# EAGLE design Qwiic_1Wire_to_I2C_Bridge_DS28E17_MILLABLE2 (EAGLE 7.6.0)
ABBREV: hb1; PROJECT: Heading Board
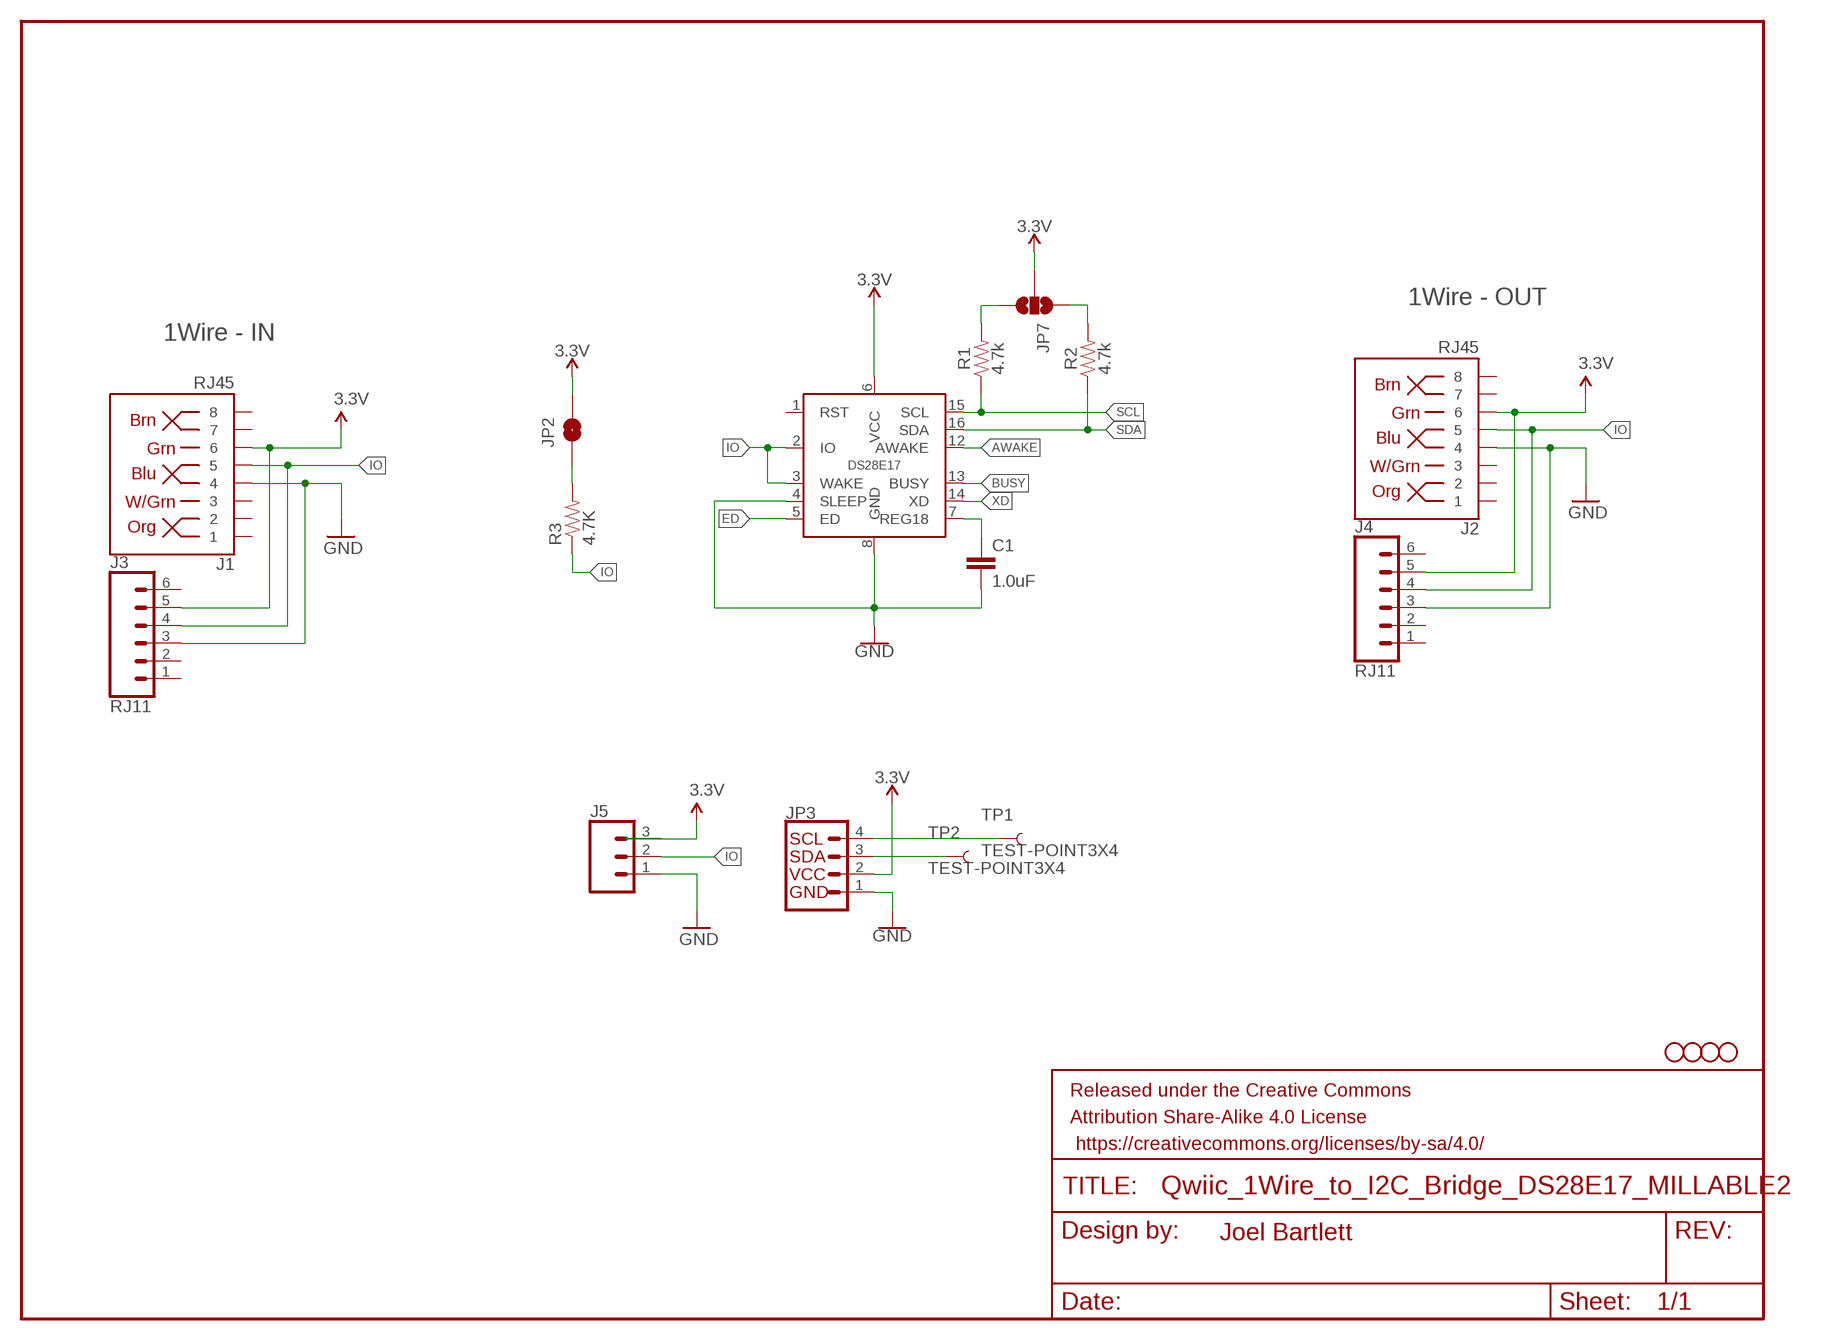
[diagram p0: schematic, sheet 1]

## Parts
C1  1.0uF  1.0UF-0603-16V-10%  [0603]
FRAME1  FRAME-LETTER  [CREATIVE_COMMONS]
H1  STAND-OFF  [STAND-OFF]
H2  STAND-OFF  [STAND-OFF]
H3  STAND-OFF  [STAND-OFF]
H4  STAND-OFF  [STAND-OFF]
J1  RJ45  RJ45-8  [RJ45-8]
J2  RJ45  RJ45-8  [RJ45-8]
J3  RJ11  RJ11-6  [RJ11-6]
J4  RJ11  RJ11-6  [RJ11-6]
J5  CONN_03  [1X03]
JP2  JUMPER-SMT_2_NO_NO-SILK  [SMT-JUMPER_2_NO_NO-SILK]
JP3  I2C_STANDARDJS-1MM  [1X04_1MM_RA]
JP7  JUMPER-SMT_3_NO_NO-SILK  [SMT-JUMPER_3_NO_NO-SILK]
R1  4.7k  4.7KOHM-0603-1/10W-1%  [0603]
R2  4.7k  4.7KOHM-0603-1/10W-1%  [0603]
R3  4.7K  4.7KOHM-1/10W-1%(0603)  [0603-RES]
TP1  TEST-POINT3X4  [PAD.03X.04]
TP2  TEST-POINT3X4  [PAD.03X.04]
U$1  DS28E17  [TQFN-16]

## Nets
3.3V: J1.6 J2.6 J3.5 J4.5 J5.3 JP2.2 JP3.2(VCC) JP7.2 U$1.6(VCC)
AWAKE: U$1.12(AWAKE)
BUSY: U$1.13(BUSY)
ED: U$1.5(ED)
GND: C1.2 J1.4 J2.4 J3.3 J4.3 J5.1 JP3.1(GND) U$1.4(SLEEP) U$1.8(GND)
IO: J1.5 J2.5 J3.4 J4.4 J5.2 R3.1 U$1.2(IO) U$1.3(WAKE)
N$1: C1.1 U$1.7(REG18)
N$2: JP2.1 R3.2
N$3: JP7.1 R2.2
N$4: JP7.3 R1.2
N$5: JP3.4(SCL) TP1.P$1
N$6: JP3.3(SDA) TP2.P$1
SCL: R1.1 U$1.15(SCL)
SDA: R2.1 U$1.16(SDA)
XD: U$1.14(XD)
Unconnected: J1.1 J1.2 J1.3 J1.7 J1.8 J2.1 J2.2 J2.3 J2.7 J2.8 J3.1 J3.2 J3.6 J4.1 J4.2 J4.6 U$1.1(RST)

## Notes on the sheet
- 1Wire - OUT
- 1Wire - IN
- Joel Bartlett

## Library data of the parts
C1 = SparkFun-Capacitors:1.0UF: 1µF ceramic capacitors A capacitor is a passive two-terminal electrical component used to store electrical energy temporarily in an electric field.; PROD_ID: CAP-00868
FRAME1 = SparkFun-Aesthetics:FRAME-LETTER: Schematic Frame - Letter Standard 8.5x11 US Letter frame
H1-H4 = SparkFun-Hardware:STAND-OFF: Stand Off Drill holes for mechanically mounting via screws, standoffs, etc. Note: Use the keepout ring to avoid running the screw head into surrounding components. Variant Overviews STAND-OFF - Mechanical footprint for a #4 phillips button head screw. STAND-OFF-TIGHT - Mechanical footprint for a #4 phillips button head screw, Example SparkFun Products Screw - Phillips Head (1/4", 4-40, 10 pack) <https://www.sparkfun.com/products/10453> (PRT-10453) Screw - Phillips Head (1/2", 4-40, 10 pack) <https://www.sparkfun.com/products/10452> (PRT-10452) Screw - Phillips Head (3/4", 4-40, 10 pack) <https://www.sparkfun.com/products/10451> (PRT-10451) Screw - Phillips Head (1", 4-40, 10 pack) <https://www.sparkfun.com/products/10450> (PRT-10450)
J1 J2 = SparkFun-Connectors:RJ45-8: RJ45 Jack - 8 pin Simple RJ45, 8-pin connection. Commonly used for Cat5, Cat5e, and Cat6 Ethernet cables. Here is the connector we sell at SparkFun: RJ45 8-Pin Connector <https://www.sparkfun.com/products/643> (PRT-00643) Datasheet <https://cdn.sparkfun.com/datasheets/Prototyping/04908.pdf> It is used on this SparkFun product: SparkFun RJ45 Breakout <https://www.sparkfun.com/products/716> (BOB-00716) Note, you may also be interested in the "MAGJACK" version of this. It is basically a RJ45 connector, but also has some status LEDs built into the connector housing. You can check that out in this library at the device named "MAGJACK.dev" and see these products online: RJ45 Ethernet MagJack-Compatible <https://www.sparkfun.com/products/8534> (PRT-08534) SparkFun RJ45 MagJack Breakout <https://www.sparkfun.com/products/13021> (BOB-13021); PROD_ID: CONN-08506; SF_ID: PRT-00643
J3 J4 = SparkFun-Connectors:RJ11-6: RJ11 Jack - 6 pin Commonly found on CAT3 devices and some Microchip programmers. Here is the connector we sell at SparkFun: RJ11 6-Pin Connector <https://www.sparkfun.com/products/132> (PRT-00132) Datasheet <http://www.sparkfun.com/datasheets/Prototyping/Connectors/RJ11-Datasheet.pdf> It is used on this SparkFun product: SparkFun Weather Shield <https://www.sparkfun.com/products/12081> (DEV-12081) Weather Meters <https://www.sparkfun.com/products/8942> (SEN-08942); PROD_ID: CONN-08590; SF_ID: PRT-00132
J5 = SparkFun-Connectors:CONN_03: Multi connection point. Often used as Generic Header-pin footprint for 0.1 inch spaced/style header connections On any of the 0.1 inch spaced packages, you can populate with these: Break Away Headers - Straight <https://www.sparkfun.com/products/116> (PRT-00116) Break Away Male Headers - Right Angle <https://www.sparkfun.com/products/553> (PRT-00553) Female Headers <https://www.sparkfun.com/products/115> (PRT-00115) Break Away Headers - Machine Pin <https://www.sparkfun.com/products/117> (PRT-00117) Break Away Female Headers - Swiss Machine Pin <https://www.sparkfun.com/products/743> (PRT-00743) Stackable Header - 3 Pin (Female, 0.1") <https://www.sparkfun.com/products/13875> (PRT-13875) For SCREWTERMINALS and SPRING TERMINALS visit here: Screw Terimnals on SparkFun.com <https://www.sparkfun.com/search/results?term=Screw+Terminals> (5mm/3.5mm/2.54mm spacing) This device is also useful as a general connection point to wire up your design to another part of your project. Our various solder wires solder well into these plated through hole pads. Hook-Up Wire - Assortment (Stranded, 22 AWG) <https://www.sparkfun.com/products/11375> (PRT-11375) Hook-Up Wire - Assortment (Solid Core, 22 AWG) <https://www.sparkfun.com/products/11367> (PRT-11367) View the entire wire category on our website here <https://www.sparkfun.com/categories/141> Special notes: Molex polarized connector foot print use with SKU : PRT-08232 with associated crimp pins and housings.
JP2 = SparkFun-Jumpers:JUMPER-SMT_2_NO: Normally open jumper This jumper has two pads in close proximity to each other. Apply solder to close the connection. Round pads are easier to solder for beginners, but are a lot larger. SparkFun Product that uses the round pads: SparkFun EL Sequencer <https://www.sparkfun.com/products/12781>
JP3 = SparkX:I2C_STANDARD: SparkFun I2C Standard Pinout Header SparkFun has standardized on a pinout for all I2C based sensor breakouts. This pinout allows I2C boards to be plugged directly into the headers on Arduino Uno compatible boards, and to be daisy chained easily. Example SparkFun Products: SparkFun Atmospheric Sensor Breakout - BME280 <https://www.sparkfun.com/products/13676> SparkFun Altitude/Pressure Sensor Breakout - MPL3115A2 <https://www.sparkfun.com/products/11084> SparkFun TOF Range Finder Sensor - VL6180 <https://www.sparkfun.com/products/12785>
JP7 = SparkFun-Jumpers:JUMPER-SMT_3_NO: Normally open jumper This jumper has three pads in close proximity to each other. Apply solder to close the connection(s).
R1 R2 = SparkFun-Resistors:4.7KOHM: 4.7kΩ resistor A resistor is a passive two-terminal electrical component that implements electrical resistance as a circuit element. Resistors act to reduce current flow, and, at the same time, act to lower voltage levels within circuits. - Wikipedia; PROD_ID: RES-07857
R3 = SparkFun-Resistors:4.7KOHM-1/10W-1%(0603): RES-07857; PROD_ID: RES-07857
TP1 TP2 = SparkFun-Connectors:TEST-POINT: SparkFun Test Points Bare copper test points for troubleshooting or In-Circuit-Testing. These are used by our Production team for verifying production board runs using pogo-pins on test beds. SparkFun Products: SparkFun LSM9DS1 Breakout <https://www.sparkfun.com/products/13284> SparkFun PSOC <https://www.sparkfun.com/products/13714> SparkFun Load Cell Amplifier <https://www.sparkfun.com/products/13879>
U$1 = SparkX:DS28E17

## Net classes
0 default: width 0.203 mm
1 power: width 0.381 mm, clearance 0.254 mm

## Board
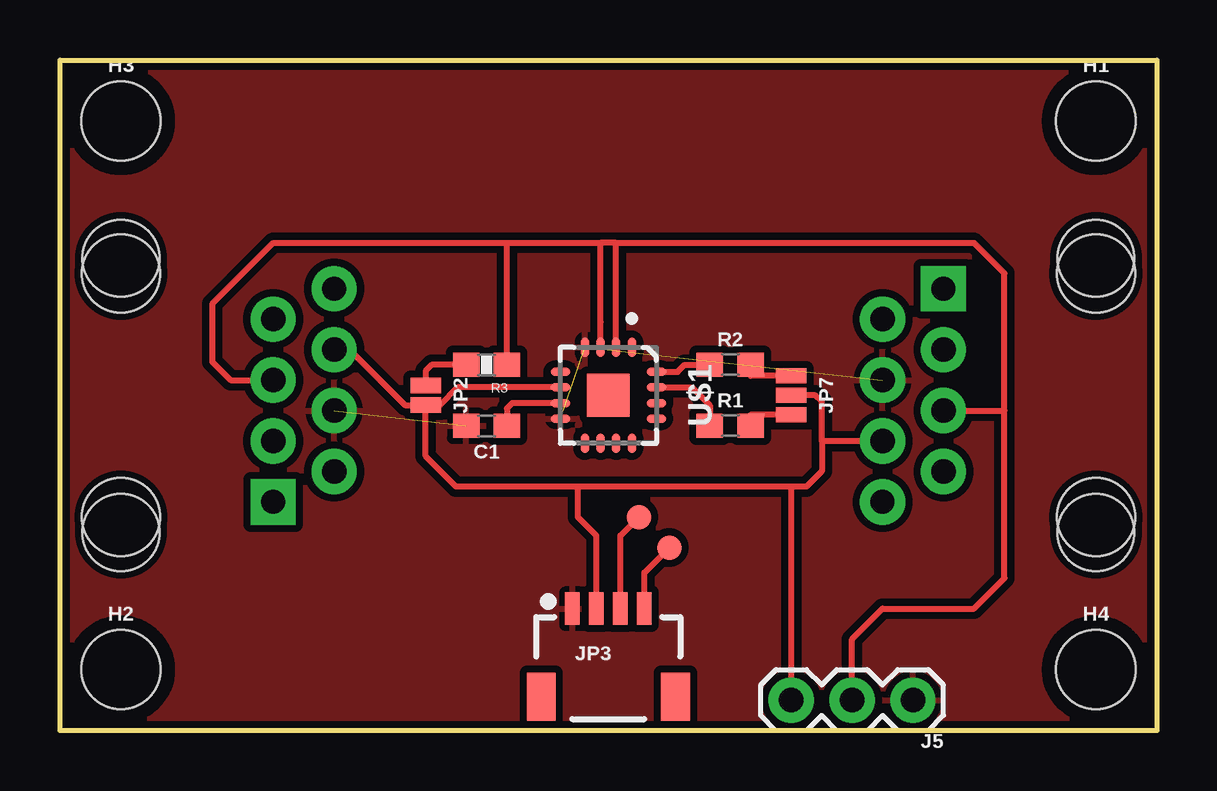
[diagram p1: board, top side]
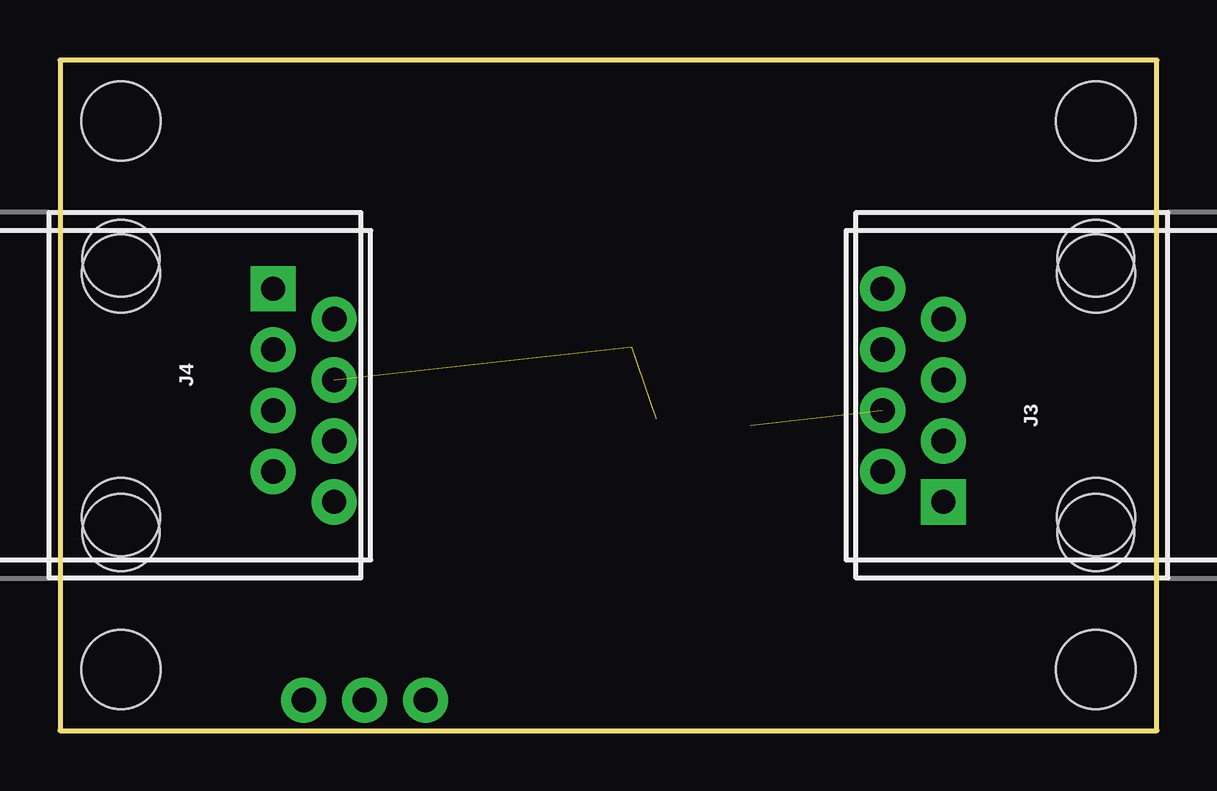
[diagram p2: board, bottom side, seen from below]

Size 45.72 x 27.94 mm. Coordinates in mm from the lower left corner, seen from the top.
Outline: 0,0 0,27.94 45.72,27.94 45.72,0 0,0
Copper layers (1*16): Top 0.035mm / dielectric 1.5mm / Bottom 0.035mm
Design rules "ITEADstudio_DRC": minimum track width 6mil, minimum drill 12mil, track to track 6mil, track to pad 6mil, pad to pad 6mil, via to via 6mil, smd to smd 0mil, copper to edge 10mil, drill to drill 10mil, minimum pad ring 10mil, minimum via ring 6mil, stop-mask expansion 2mil, vias tented up to drill 100mil, thermal gap 10mil

### Footprints (pad centres in the part's own frame; a part is rotated, then mirrored left to right if it is on the bottom)
0603 = smd 1.1 x 1: 1 -0.85,0; 2 0.85,0
STAND-OFF = hole 3.302: 0,0
RJ45-8 = drill 1 pad 1.88 square: 1 -4.445,6.35 | drill 1 pad 1.88: 2 -3.175,8.89; 3 -1.905,6.35; 4 -0.635,8.89; 5 0.635,6.35; 6 1.905,8.89; 7 3.175,6.35; 8 4.445,8.89 | hole 3.2: -5.715,0; 5.715,0
RJ11-6 = drill 1.016 pad 1.88: 1 -3.175,8.89; 2 -1.905,6.35; 3 -0.635,8.89; 4 0.635,6.35; 5 1.905,8.89; 6 3.175,6.35 | hole 3.251: -5.08,0; 5.08,0
1X03 = drill 1.016 pad 1.88: 1 0,0; 2 2.54,0; 3 5.08,0
SMT-JUMPER_2_NO_NO-SILK = smd 0.635 x 1.27: 1 -0.406,0; 2 0.406,0
1X04_1MM_RA = smd 0.6 x 1.35: 1 -1.5,0; 2 -0.5,0; 3 0.5,0; 4 1.5,0 | smd 1.2 x 2: NC1 2.8,-3.675; NC2 -2.8,-3.675
SMT-JUMPER_3_NO_NO-SILK = smd 0.635 x 1.27: 1 -0.813,0; 2 0,0; 3 0.813,0
0603-RES = smd 1.1 x 1: 1 -0.85,0; 2 0.85,0
PAD.03X.04 = smd 1.016 x 1.016: P$1 0,0
TQFN-16 = smd 0.8 x 0.35: 1 -2,0.975; 2 -2,0.325; 3 -2,-0.325; 4 -2,-0.975; 9 2,-0.975; 10 2,-0.325; 11 2,0.325; 12 2,0.975 | smd 0.35 x 0.8: 5 -0.975,-2; 6 -0.325,-2; 7 0.325,-2; 8 0.975,-2; 13 0.975,2; 14 0.325,2; 15 -0.325,2; 16 -0.975,2 | smd 1.778 x 1.778: PAD 0,0

### Placement (x,y rotation side)
C1  17.78,12.7 180 top
FRAME1  -5.08,-16.51 0 top  (outside the outline)
H1  43.18,25.4 0 top
H2  2.54,2.54 0 top
H3  2.54,25.4 0 top
H4  43.18,2.54 0 top
J1  2.54,13.97 90 bottom
J2  43.18,13.97 270 bottom
J3  2.54,13.97 90 bottom
J4  43.18,13.97 270 bottom
J5  35.56,1.27 180 top
JP2  15.24,13.97 270 top
JP3  22.86,5.08 0 top
JP7  30.48,13.97 270 top
R1  27.94,12.7 0 top
R2  27.94,15.24 0 top
R3  17.78,15.24 180 top
TP1  25.4,7.62 0 top
TP2  24.13,8.89 0 top
U$1  22.86,13.97 270 top

### Tracks (layer width: path | path; a pad name or v marks a point on that pad's centre or on a via)
3.3V
  Top 0.254: JP3.2 22.36,8.12 21.59,8.89 21.59,10.16 | U$1.6 16.58,14.29 15.85,13.56 JP2.2 | J5.3 30.48,10.16 | 30.48,10.16 21.59,10.16 | 30.48,10.16 31.11,10.16 31.75,10.79 31.75,12.06 | J4.5 31.75,12.06 | 31.75,12.06 31.75,13.72 31.5,13.97 JP7.2 | 21.59,10.16 16.51,10.16 15.24,11.43 JP2.2 | J3.5 12.06,15.88 14.38,13.56 JP2.2
GND  (3 unrouted)
  pour Top (isolate 0.305): 0,27.94 0,0 45.72,0 45.72,27.94
IO
  Top 0.254: 22.54,17.02 U$1.3 22.54,20.32 | J5.2 33.02,3.81 34.29,5.08 38.1,5.08 39.37,6.35 39.37,13.34 | 39.37,13.34 39.37,19.05 38.1,20.32 23.18,20.32 | J4.4 39.37,13.34 | 18.63,20.32 8.89,20.32 6.35,17.78 6.35,15.37 7.11,14.61 J3.4 | 18.63,20.32 22.54,20.32 | R3.1 18.63,20.32 | U$1.2 23.18,20.32 | 23.18,20.32 22.54,20.32
N$1
  Top 0.254: U$1.7 18.85,13.64 18.63,13.42 C1.1
N$2
  Top 0.254: R3.2 15.49,15.24 15.24,14.99 JP2.1
N$3
  Top 0.254: 29.04,14.99 R2.2 28.79,14.78 JP7.1
N$4
  Top 0.254: 29.04,12.95 R1.2 28.79,13.16 JP7.3
N$5
  Top 0.254: JP3.4 24.36,6.58 TP1.P$1
N$6
  Top 0.254: JP3.3 23.36,8.12 TP2.P$1
SCL
  Top 0.254: R1.1 27.09,13.55 26.34,14.29 U$1.15
SDA
  Top 0.254: R2.1 26.04,15.24 25.74,14.95 U$1.16

### Text on the board
tPlace: 1Wire-to-I2C / Bridge DS28E17
tDocu: Joel Bartlett